# EAGLE schematic slipsensor_v2 (EAGLE 9.6.2)
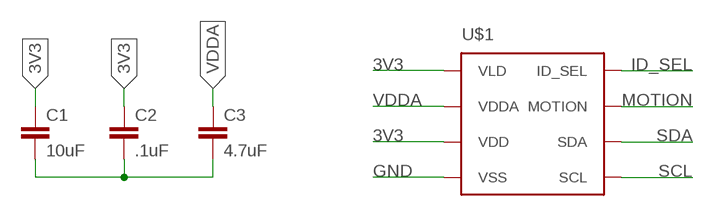
[diagram p0: schematic, sheet 1]

## Parts
C1  10uF  C-EUC0402  [C0402]
C2  .1uF  C-EUC0402  [C0402]
C3  4.7uF  C-EUC0402  [C0402]
U$1  PAT9125EL  [PAT9125EL]

## Nets
3V3: C1.1 C2.1 U$1.P$1(VLD) U$1.P$3(VDD)
GND: C1.2 C2.2 C3.2 U$1.P$4(VSS)
ID_SEL: U$1.P$8(ID_SEL)
MOTION: U$1.P$7(MOTION)
SCL: U$1.P$5(SCL)
SDA: U$1.P$6(SDA)
VDDA: C3.1 U$1.P$2(VDDA)

## Library data of the parts
C1-C3 = rcl:C-EU: CAPACITOR, European symbol; SPICEPREFIX: C
U$1 = Limbo:PAT9125EL